# EAGLE design USB Codec (EAGLE 7.2.0)
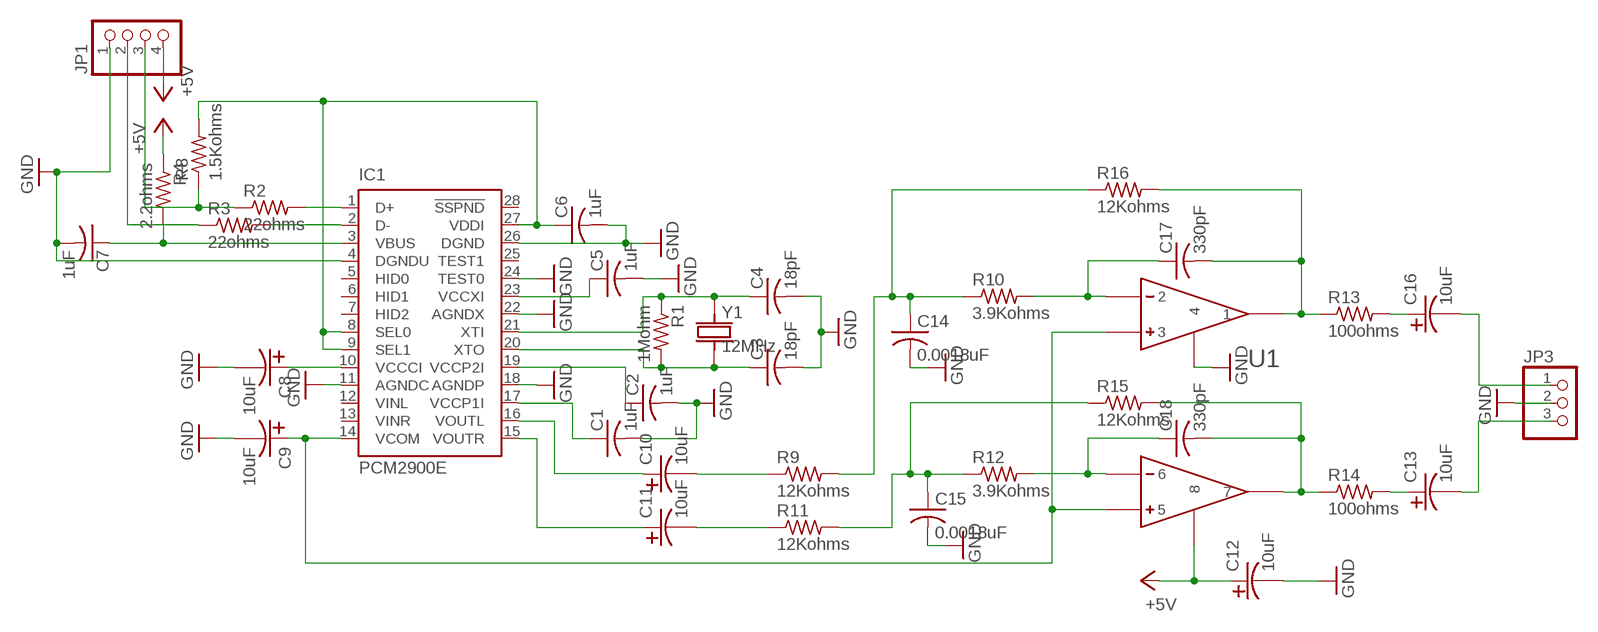
[diagram p0: schematic, sheet 1]

## Parts
C1  1uF  CAP0603  [0603_CAP]
C2  1uF  CAP0603  [0603_CAP]
C3  18pF  CAP0603  [0603_CAP]
C4  18pF  CAP0603  [0603_CAP]
C5  1uF  CAP0603  [0603_CAP]
C6  1uF  CAP0603  [0603_CAP]
C7  1uF  CAP0603  [0603_CAP]
C8  10uF  CAP-TANT  [1411_CAP]
C9  10uF  CAP-TANT  [1411_CAP]
C10  10uF  CAP-TANT  [1411_CAP]
C11  10uF  CAP-TANT  [1411_CAP]
C12  10uF  CAP-TANT  [1411_CAP]
C13  10uF  CAP-TANT  [1411_CAP]
C14  0.0018uF  CAP0603  [0603_CAP]
C15  0.0018uF  CAP0603  [0603_CAP]
C16  10uF  CAP-TANT  [1411_CAP]
C17  330pF  CAP0603  [0603_CAP]
C18  330pF  CAP0603  [0603_CAP]
IC1  PCM2900E  [SSOP28DB]
JP1  PINHD-1X4  [1X04]
JP3  PINHD-1X3  [1X03]
R1  1Mohm  RESISTOR0603  [0603_RESISTOR]
R2  22ohms  RESISTOR0603  [0603_RESISTOR]
R3  22ohms  RESISTOR0603  [0603_RESISTOR]
R4  2.2ohms  RESISTOR0603  [0603_RESISTOR]
R8  1.5Kohms  RESISTOR0603  [0603_RESISTOR]
R9  12Kohms  RESISTOR0603  [0603_RESISTOR]
R10  3.9Kohms  RESISTOR0603  [0603_RESISTOR]
R11  12Kohms  RESISTOR0603  [0603_RESISTOR]
R12  3.9Kohms  RESISTOR0603  [0603_RESISTOR]
R13  100ohms  RESISTOR0603  [0603_RESISTOR]
R14  100ohms  RESISTOR0603  [0603_RESISTOR]
R15  12Kohms  RESISTOR0603  [0603_RESISTOR]
R16  12Kohms  RESISTOR0603  [0603_RESISTOR]
U1  OP-AMP  [OPA2353UA]
Y1  12MHz  CRYSTAL5X3  [CRYSTAL_5X3]

## Nets
+5V: C12.P$1 JP1.4 R4.1 U1.P$8
GND: C1.2 C2.2 C3.2 C4.2 C5.2 C6.2 C7.2 C8.P$2 C9.P$2 C12.P$2 C14.2 C15.2 IC1.4(DGNDU) IC1.11(AGNDC) IC1.18(AGNDP) IC1.22(AGNDX) IC1.24(TEST0) IC1.26(DGND) JP1.1 JP3.2 U1.P$4
N$1: C1.1 IC1.17(VCCP1I)
N$2: IC1.1(D+) R2.2
N$3: JP1.3 R2.1 R8.1
N$4: C6.1 IC1.8(SEL0) IC1.9(SEL1) IC1.27(VDDI) R8.2
N$5: IC1.2(D-) R3.2
N$6: JP1.2 R3.1
N$7: C5.1 IC1.23(VCCXI)
N$10: C10.P$2 R9.1
N$11: C2.1 IC1.19(VCCP2I)
N$13: C11.P$2 R11.1
N$14: C4.1 IC1.21(XTI) R1.1 Y1.1
N$15: C3.1 IC1.20(XTO) R1.2 Y1.2
N$16: C17.1 R10.2 U1.P$2
N$17: C18.1 R12.2 U1.P$6
N$20: C7.1 IC1.3(VBUS) R4.2
N$22: C8.P$1 IC1.10(VCCCI)
N$23: C9.P$1 IC1.14(VCOM) U1.P$3 U1.P$5
N$24: C14.1 R9.2 R10.1 R16.1
N$25: C10.P$1 IC1.16(VOUTL)
N$26: C11.P$1 IC1.15(VOUTR)
N$27: C15.1 R11.2 R12.1 R15.1
N$28: C17.2 R13.1 R16.2 U1.P$1
N$29: C16.P$2 JP3.1
N$30: C18.2 R14.1 R15.2 U1.P$7
N$31: C13.P$2 JP3.3
N$33: C16.P$1 R13.2
N$34: C13.P$1 R14.2
Unconnected: IC1.5(HID0) IC1.6(HID1) IC1.7(HID2) IC1.12(VINL) IC1.13(VINR) IC1.25(TEST1) IC1.28(!SSPND)

## Library data of the parts
C1-C7 C14 C15 C17 C18 = jkf:CAP
C8-C13 C16 = 1parts:CAP-TANT
IC1 = texas:PCM29*: STEREO AUDIO CODEC WITH USB INTERFACE SINGLE-ENDED ANALOG INPUT/OUTPUT AND S/PDIF; MF: TEXAS INSTRUMENTS; MPN: PCM2900E; OC_FARNELL: 1207086; OC_NEWARK: 75C5376
JP1 = pinhead:PINHD-1X4: PIN HEADER
JP3 = pinhead:PINHD-1X3: PIN HEADER
R1-R4 R8-R16 = jkf:RESISTOR
U1 = 1parts:OP-AMP: Datasheet: http://www.ti.com/lit/ds/symlink/opa2353.pdf; DIGI-KEY: 296-26259-1-ND
Y1 = jkf:CRYSTAL

## Board
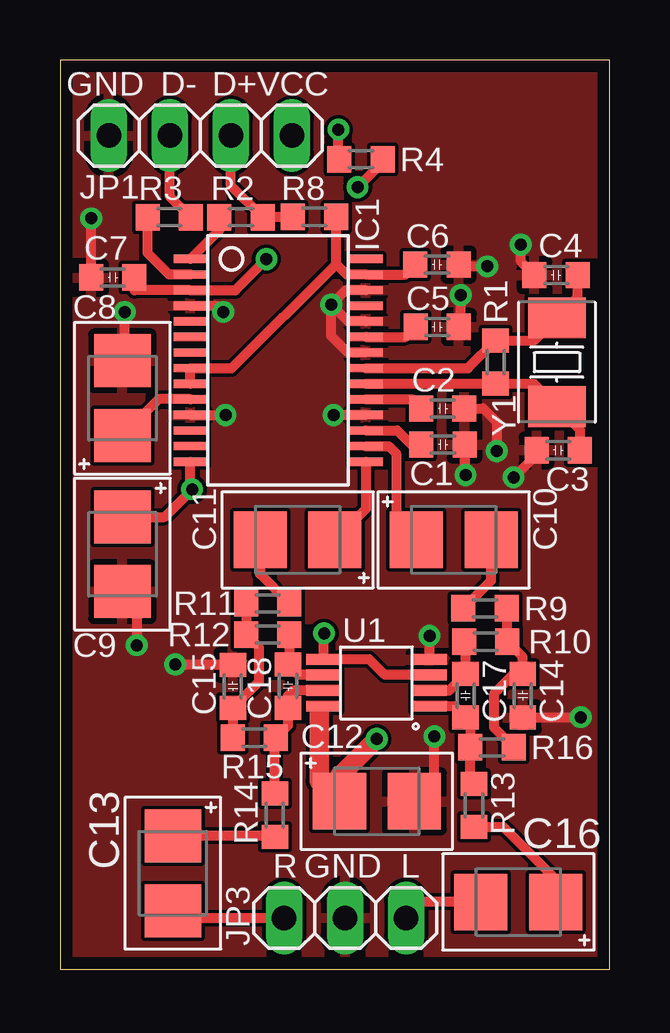
[diagram p1: board, top side]
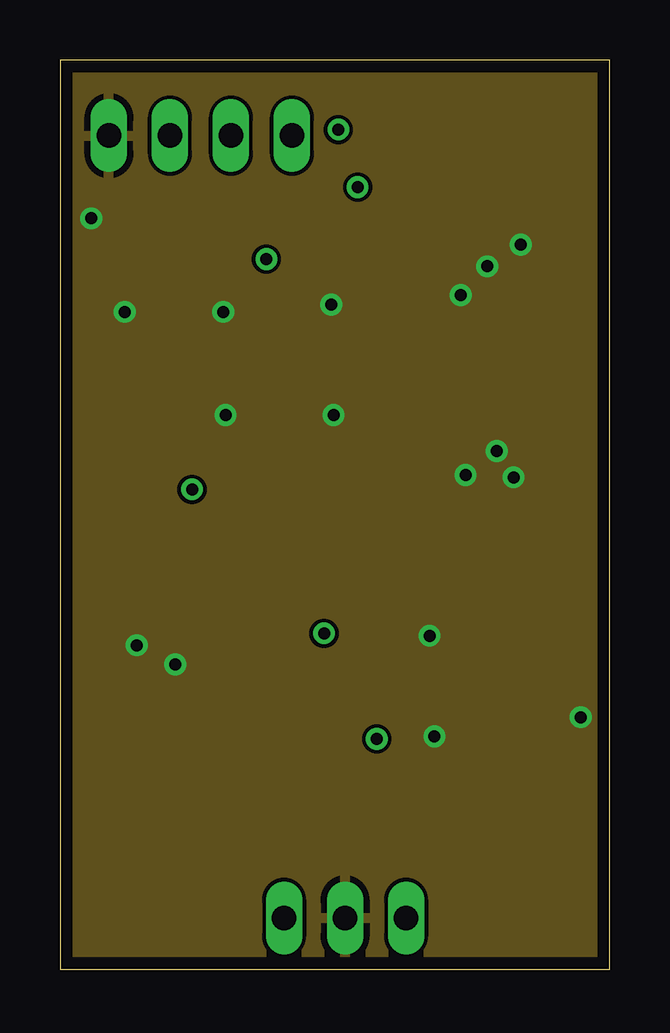
[diagram p2: board, inner layer GND]
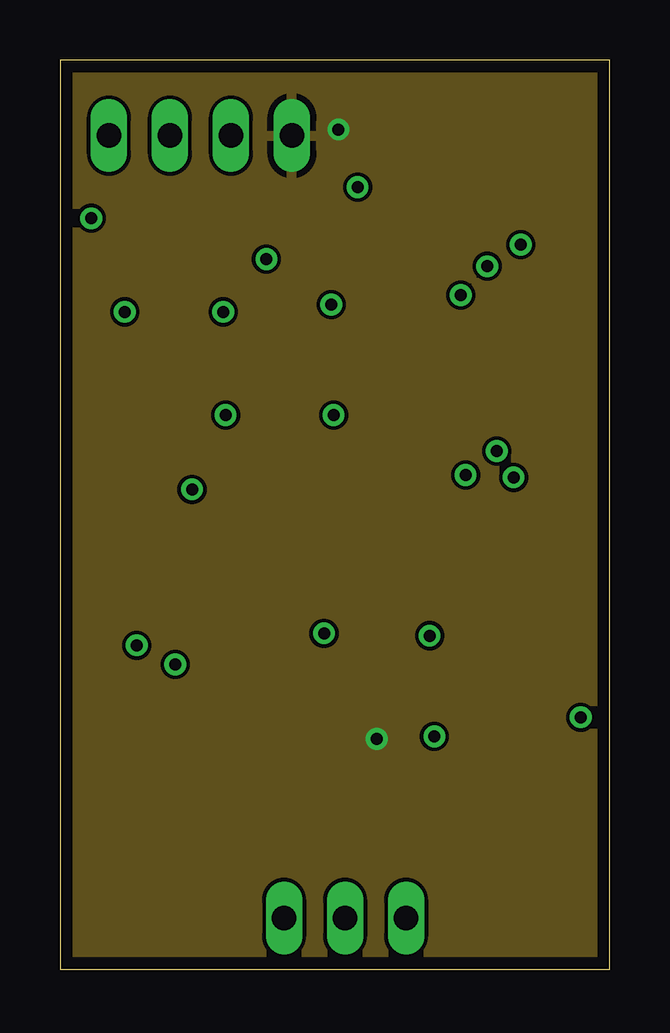
[diagram p3: board, inner layer +5V]
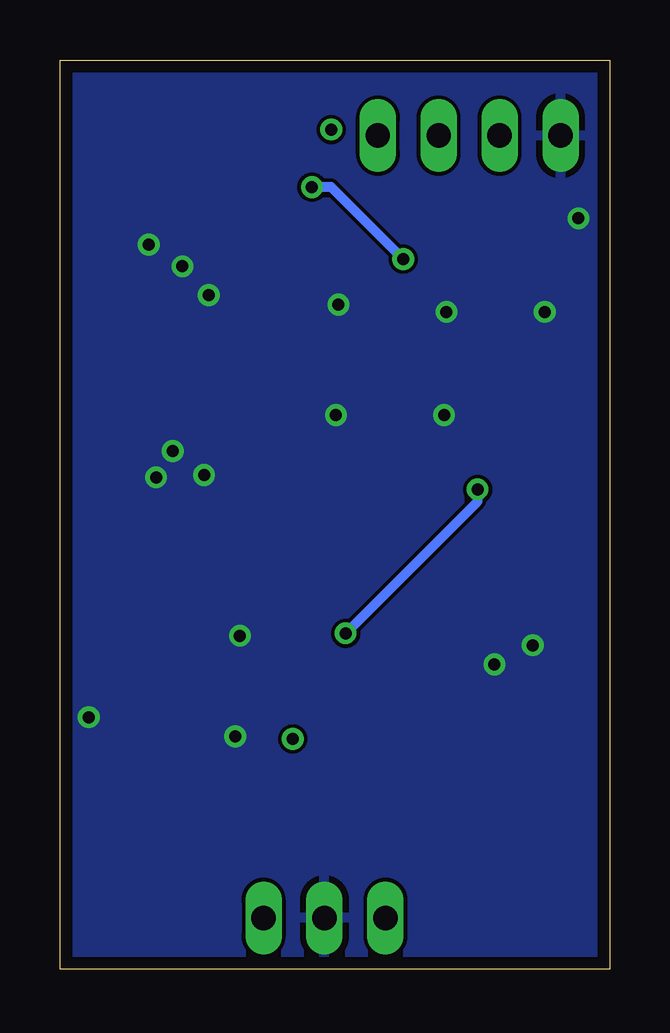
[diagram p4: board, bottom side, seen from below]

Size 22.9 x 37.9 mm. Coordinates in mm from the lower left corner, seen from the top.
Outline: 0,0 22.9,0 22.9,37.9 0,37.9 0,0
Copper layers (1+2*15+16): Top 0.0178mm / dielectric 12mil / GND 0.0356mm / dielectric 28mil / +5V 0.0356mm / dielectric 12mil / Bottom 0.0178mm
Design rules "SSC-EAGLE-4Lyr_v1.0.0.3": minimum track width 6mil, minimum drill 8mil, track to track 6mil, track to pad 6mil, pad to pad 6mil, via to via 6mil, smd to smd 6mil, copper to edge 20mil, drill to drill 16mil, minimum pad ring 8mil, minimum via ring 8mil, stop-mask expansion 3mil, vias tented up to drill 0mil, thermal gap 10mil

### Footprints (pad centres in the part's own frame; a part is rotated, then mirrored left to right if it is on the bottom)
0603_CAP = smd 1 x 1.1: 1 -0.9,0; 2 0.9,0
1411_CAP = smd 2.21 x 2.35: P$1 -1.555,0; P$2 1.565,0
SSOP28DB = smd 0.348 x 1.397: 1 -4.225,-3.656; 2 -3.575,-3.656; 3 -2.925,-3.656; 4 -2.275,-3.656; 5 -1.625,-3.656; 6 -0.975,-3.656; 7 -0.325,-3.656; 8 0.325,-3.656; 9 0.975,-3.656; 10 1.625,-3.656; 11 2.275,-3.656; 12 2.925,-3.656; 13 3.575,-3.656; 14 4.225,-3.656; 15 4.225,3.656; 16 3.575,3.656; 17 2.925,3.656; 18 2.275,3.656; 19 1.625,3.656; 20 0.975,3.656; 21 0.325,3.656; 22 -0.325,3.656; 23 -0.975,3.656; 24 -1.625,3.656; 25 -2.275,3.656; 26 -2.925,3.656; 27 -3.575,3.656; 28 -4.225,3.656
1X04 = drill 1.016 long: 1 -3.81,0; 2 -1.27,0; 3 1.27,0; 4 3.81,0
1X03 = drill 1.016 long: 1 -2.54,0; 2 0,0; 3 2.54,0
0603_RESISTOR = smd 1 x 1.1: 1 -0.9,0; 2 0.9,0
OPA2353UA = smd 0.45 x 1.45: P$1 -0.975,-2.2; P$2 -0.325,-2.2; P$3 0.325,-2.2; P$4 0.975,-2.2; P$5 0.975,2.2; P$6 0.325,2.2; P$7 -0.325,2.2; P$8 -0.975,2.2
CRYSTAL_5X3 = smd 1.7 x 2.4: 1 -1.85,0; 2 1.85,0

### Placement (x,y rotation side)
C1  15.96,21.87 0 top
C2  15.95,23.37 0 top
C3  20.76,21.63 180 top
C4  20.67,28.93 180 top
C5  15.72,26.77 0 top
C6  15.71,29.37 0 top
C7  2.2,28.83 180 top
C8  2.6,23.8 90 top
C9  2.6,17.3 270 top
C10  16.4,17.9 0 top
C11  9.9,17.9 180 top
C12  13.2,7 0 top
C13  4.7,4 270 top
C14  19.28,11.4 270 top
C15  7.2,11.79 90 top
C16  19.1,2.8 180 top
C17  16.9,11.4 270 top
C18  9.5,11.8 270 top
IC1  9.09,25.38 270 top
JP1  5.85,34.75 0 top
JP3  11.88,2.13 180 top
R1  18.15,25.31 270 top
R2  7.54,31.34 180 top
R3  4.55,31.34 180 top
R4  12.54,33.76 0 top
R8  10.6,31.36 0 top
R9  17.71,15.04 0 top
R10  17.74,13.65 180 top
R11  8.65,15.25 180 top
R12  8.66,13.95 0 top
R13  17.25,6.83 270 top
R14  8.95,6.42 270 top
R15  8.09,9.65 0 top
R16  18,9.25 180 top
U1  13.18,11.94 90 top
Y1  20.7,25.3 270 top

### Tracks (layer width: path | path; a pad name or v marks a point on that pad's centre or on a via)
+5V  (via drill 0.5 pad 0.25)
  Top 0.406: C12.P$1 10.98,7.67 | 11.64,8.04 C12.P$1 | U1.P$8 10.8,10.79 | 10.8,7.84 C12.P$1 | R4.1 11.6,33.8 v11.6,35
  Top 0.813: v13.2,9.6 11.64,8.04 | 10.8,10.79 10.8,7.84
  pour +5V: 0,37.9 0,0 22.9,0 22.9,37.9
GND  (via drill 0.5 pad 0.25)
  Top 0.406: C5.2 16.7,26.87 v16.7,28.1 | IC1.4 6.54,27.66 v6.8,27.4 | IC1.11 v6.89,23.11 v6.9,23.1 | IC1.18 v11.4,23.11 v11.4,23.1 | U1.P$4 15.4,12.94 v15.4,13.9 | C12.P$2 15.6,7.83 v15.6,9.7 | C15.2 v4.81,12.69 v4.8,12.7 | C14.2 v21.7,10.5 | 18.23,21.63 v18.2,21.6 18.2,22.8 17.63,23.37 C2.2 | C1.2 16.86,20.64 v16.9,20.6 | 2.6,25.3 C8.P$2 2.7,25.36 v2.7,27.4 | IC1.26 11.9,28.3 v11.3,27.7 | IC1.24 11.99,27 v11.3,27.7 | IC1.22 11.99,25.7 11.3,26.4 v11.3,27.7 | C9.P$2 3.2,15.73 v3.2,13.5 | C3.2 19.86,21.46 v18.9,20.5 | C6.2 16.68,29.3 v17.8,29.3 | C4.2 19.2,29.5 v19.2,30.2 | C7.2 v1.3,31.3
  pour GND: 0,0 22.9,0 22.9,37.9 0,37.9
  pour Bottom: 0,0 22.9,0 22.9,37.9 0,37.9
  pour Top: 0,0 22.9,0 22.9,37.9 0,37.9
N$1
  Top 0.406: IC1.17 14.04,22.45 14.63,21.87 C1.1
N$2
  Top 0.406: IC1.1 6.64,30.81 R2.2
N$3
  Top 0.406: JP1.3 7.12,32.66 R2.1 8.46,31.36 R8.1
N$4
  Top 0.406: IC1.9 IC1.8 7.16,25.05 11.5,29.4 | C6.1 14.39,28.95 IC1.27 11.95,28.95 11.5,29.4 | 11.5,29.4 R8.2
N$5
  Top 0.406: IC1.2 4.54,28.95 3.65,29.85 R3.2
N$6
  Top 0.406: R3.1 4.58,32.21 JP1.2
N$7
  Top 0.406: IC1.23 14.4,26.36 C5.1
N$10
  Top 0.406: R9.1 17.96,16.2 C10.P$2
N$11
  Top 0.406: IC1.19 14.66,23.75 C2.1
N$13
  Top 0.406: C11.P$2 8.34,16.46 R11.1
N$14
  Top 0.406: C4.1 21.57,28.02 Y1.1 19.76,26.21 R1.1 17,25.05 IC1.21
N$15
  Top 0.406: C3.1 21.66,22.49 Y1.2 19.74,24.41 R1.2 IC1.20
N$16
  Top 0.406: U1.P$2 16.21,11.62 C17.1 16.9,13.59 R10.2
N$17
  Top 0.406: R12.2 9.56,12.76 C18.1 9.94,12.27 U1.P$6
N$20  (via drill 0.5 pad 0.25)
  Top 0.406: v12.4,32.6 13.44,33.64 R4.2 | v8.6,29.6 7.3,28.3 IC1.3 3.1,28.3 C7.1
  Bottom 0.406: v8.6,29.6 11.6,32.6 v12.4,32.6
N$22
  Top 0.406: IC1.10 4.11,23.75 C8.P$1
N$23  (via drill 0.5 pad 0.25)
  Top 0.406: U1.P$3 13.54,12.27 12.88,12.91 U1.P$5 10.98,13.98 v11,14 | IC1.14 5.43,20.07 v5.5,20 4.36,18.86 C9.P$1
  Bottom 0.406: v11,14 5.5,19.5 v5.5,20
N$24
  Top 0.406: R9.2 18.64,15.01 R10.1 19.28,13.01 C14.1 18.9,12.3 18.1,11.5 18.1,10.05 R16.1
N$25
  Top 0.406: IC1.16 13.7,21.8 14,21.5 14,18.75 C10.P$1
N$26
  Top 0.406: IC1.15 12.75,19.19 C11.P$1
N$27
  Top 0.406: R11.2 R12.1 8.3,13.41 8.3,11.99 C15.1 R15.1
N$28
  Top 0.406: U1.P$1 16.43,10.96 C17.2 17.1,10.3 R16.2 17.1,7.88 R13.1
N$29
  Top 0.406: C16.P$2 15.09,2.8 JP3.1
N$30
  Top 0.406: U1.P$7 9.71,11.62 9.5,11.4 C18.2 9.5,10.16 R15.2 8.95,9.61 R14.1
N$31
  Top 0.406: C13.P$2 5,2.13 JP3.3
N$33
  Top 0.406: R13.2 18.47,5.93 20.66,3.75 C16.P$1
N$34
  Top 0.406: R14.2 8.91,5.55 C13.P$1

### Text on the board
tNames: GND | D- | D+ | VCC | R | GND | L